# EasyEDA schematic open-ebike-latch.json
TITLE: Sheet_1; REV: 1.0; Date: 2021-06-18; Sheet: 1/1; Company: Stefano
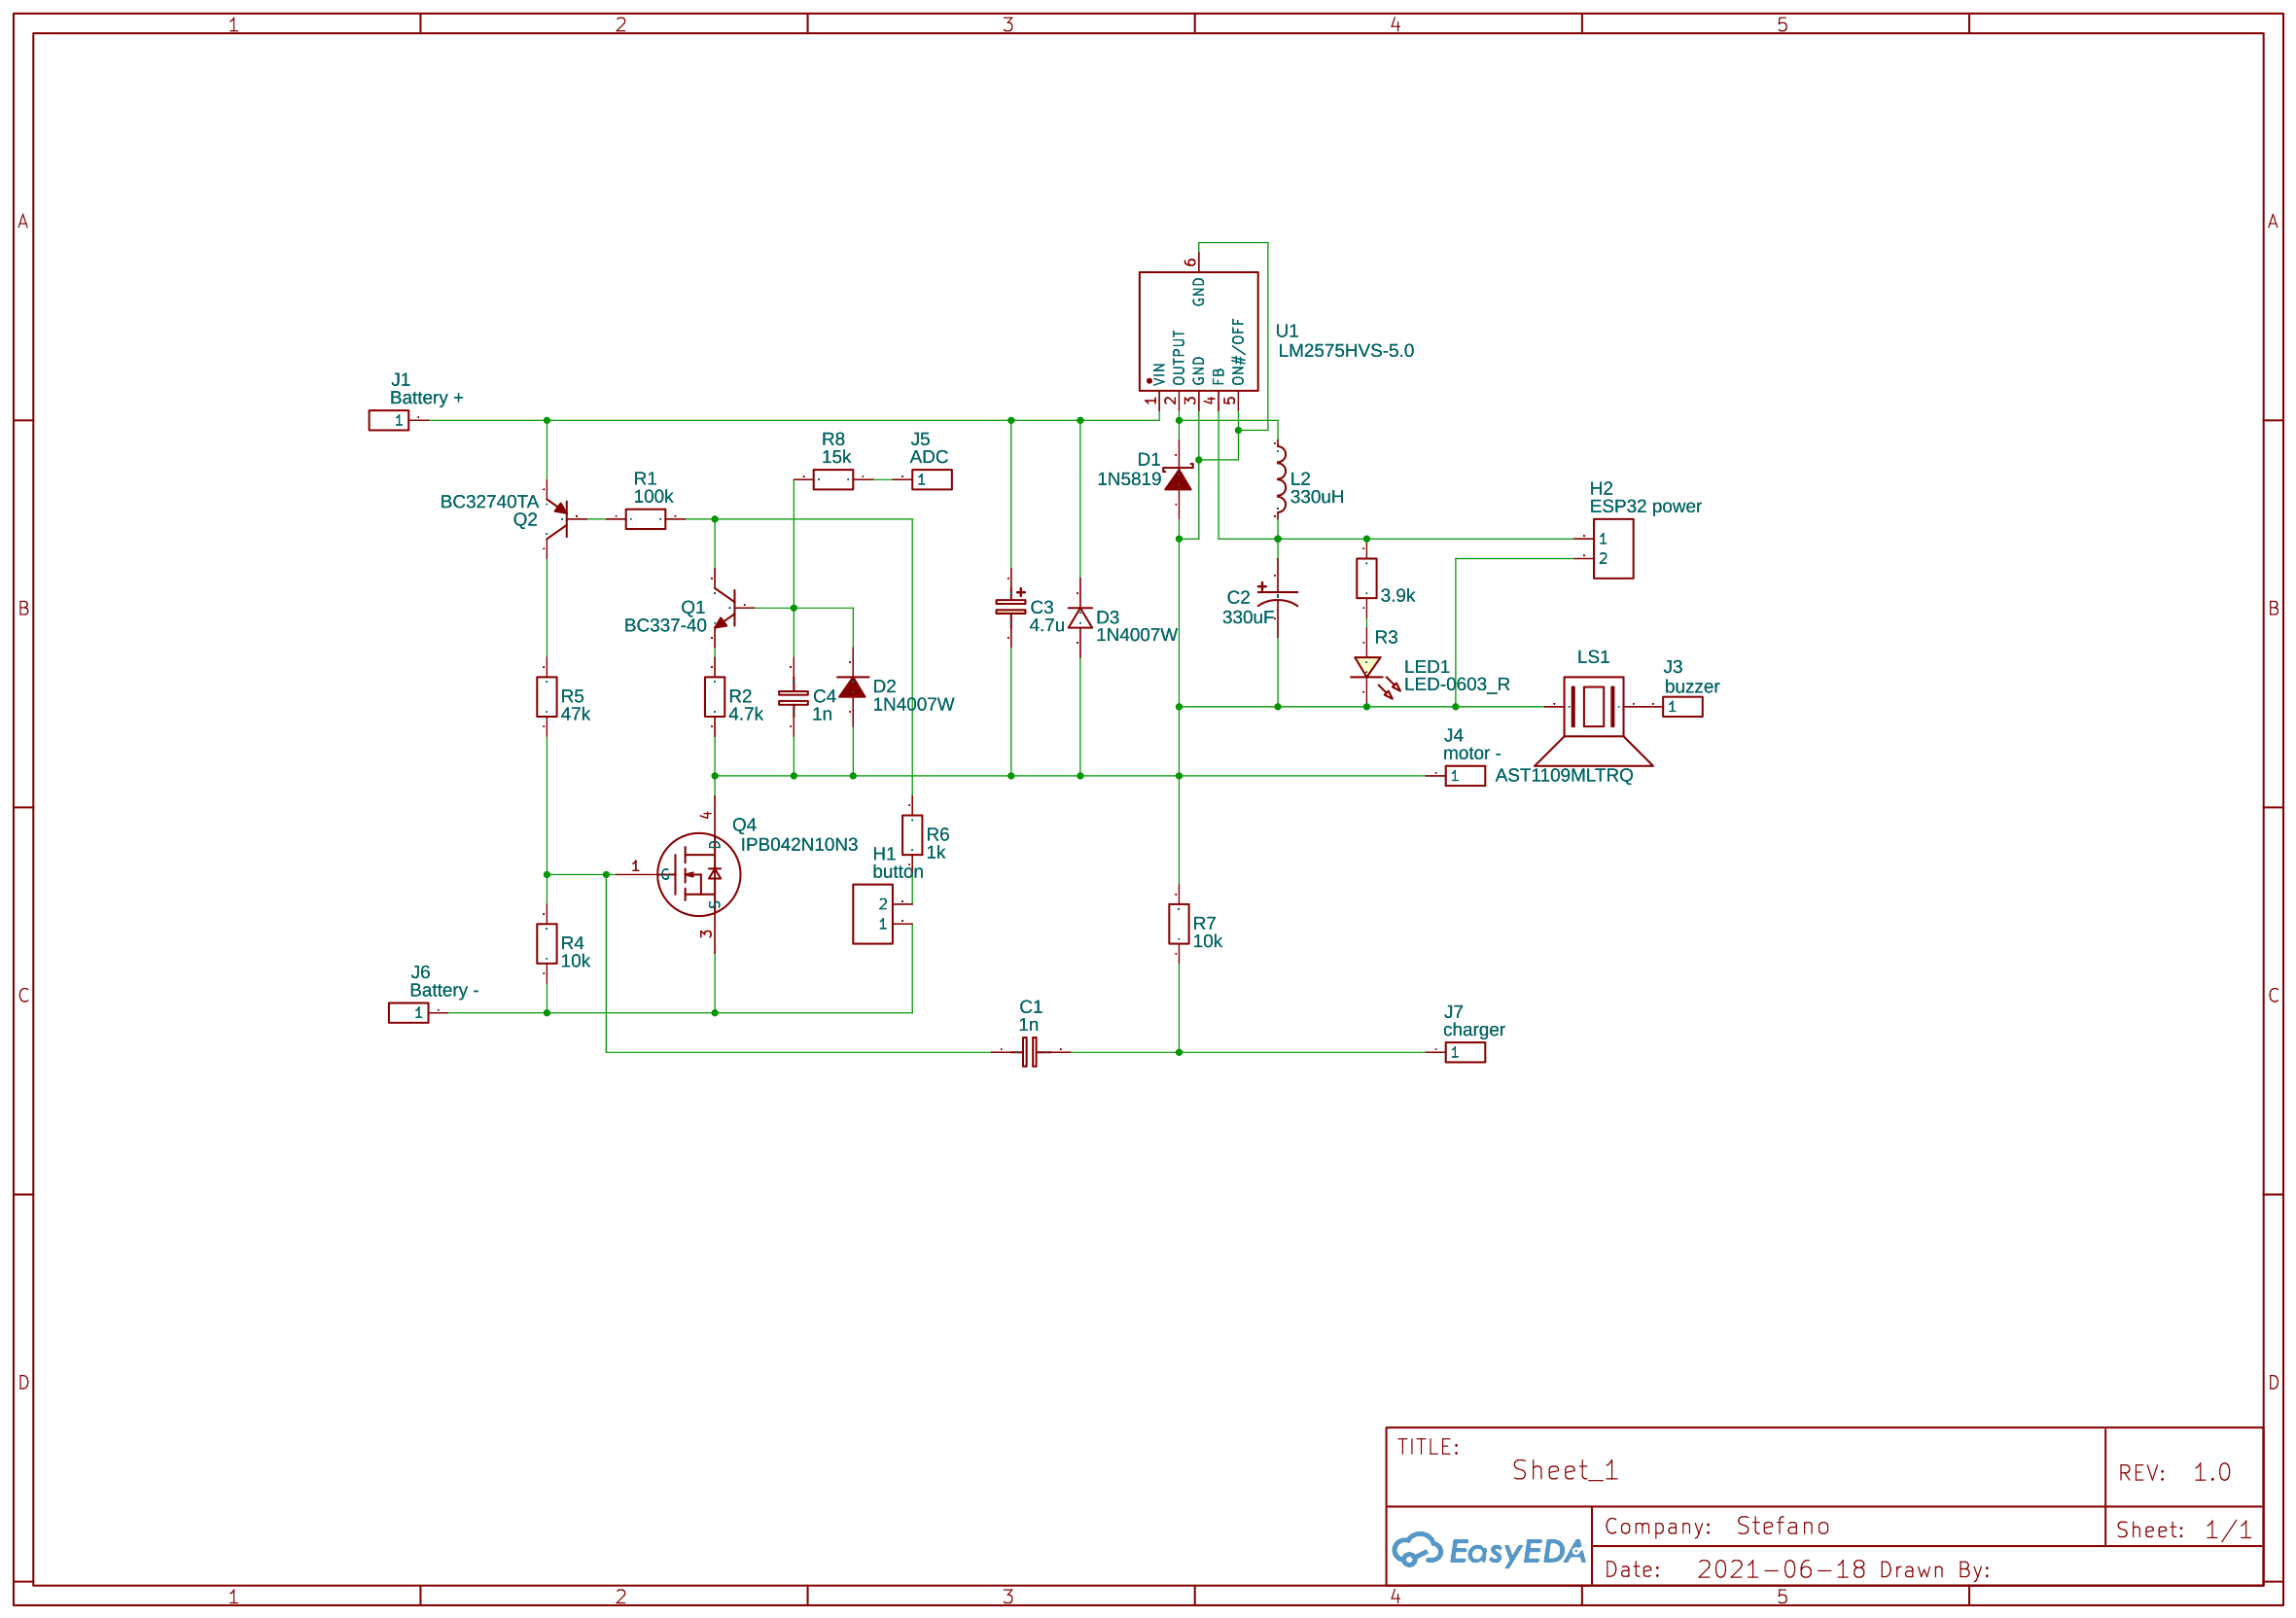
[diagram p0: schematic sheet]

## Parts
C1  1n  [RAD-0.2]
C2  330uF  [CAP-D5.0×F2.0]
C3  4.7u  [CAP-D5.0×F2.0]
C4  1n  [RAD-0.2]
D1  1N5819  [DO-41_BD2.4-L4.7-P8.70-D0.9-FD]
D2  1N4007W  [DO-35_BD2.0-L4.2-P8.20-D0.5-RD]
D3  1N4007W  [DO-35_BD2.0-L4.2-P8.20-D0.5-RD]
H1  button  [HDR-F-2.54_1X2]
H2  ESP32 power  [HDR-F-2.54_1X2]
J1  Battery +  [HDR-M-2.54_1X1]
J3  buzzer  [HDR-M-2.54_1X1]
J4  motor -  [HDR-M-2.54_1X1]
J5  ADC  [HDR-M-2.54_1X1]
J6  Battery -  [HDR-M-2.54_1X1]
J7  charger  [HDR-M-2.54_1X1]
L2  330uH  [INDUCTOR 330UH 12X12X7MM]
LED1  LED-0603_R  [LED0603_RED]
LS1  AST1109MLTRQ  [PIEZO]
Q1  BC337-40  [TO-92-3_L5.1-W4.1-P1.27-L]
Q2  BC32740TA  [TO-92-3_L5.1-W4.1-P1.27-L]
Q4  IPB042N10N3  [TO-263-2_L10.0-W9.1-P5.08-LS15.2-TL]
R1  100k  [R_AXIAL-0.4]
R2  4.7k  [R_AXIAL-0.4]
R3  3.9k  [R_AXIAL-0.4]
R4  10k  [R_AXIAL-0.4]
R5  47k  [R_AXIAL-0.4]
R6  1k  [R_AXIAL-0.4]
R7  10k  [R_AXIAL-0.4]
R8  15k  [R_AXIAL-0.4]
U1  LM2575HVS-5.0  [TO-263-5_L10.2-W8.9-P1.70-BR]

## Library data of the parts
C1 C4 = C_RAD-0.2_EU: Contributor: LCEDA_Lib; Package Display: No
C2 = UWX0J331MCL1GB: Supplier: LCSC; Supplier Part: C445051; Manufacturer: Nichicon; Contributor: LCSC
C3 = CE_TH_D5.0×F2.0_EU: Contributor: LCEDA_Lib
D1 = 1N5819: Supplier: LCSC; Manufacturer: STMicroelectronics; Supplier Part: C110032; JLCPCB Part Class: Extended Part
D2 = 1N4148: Supplier: LCSC; Manufacturer: SEMTECH; Supplier Part: C14516; JLCPCB Part Class: Extended Part
D3 = 1N4007W: Supplier: LCSC; Supplier Part: C328592; Manufacturer: BLUE ROCKET; Contributor: LCEDA_Lib
H1 H2 = HDR-F-2.54_1x2: Supplier Part: C49661; Supplier: LCSC; Contributor: LCEDA_Lib
J1 J3-J7 = HDR-M-2.54_1x1: Supplier Part: C81276; Supplier: LCSC; Contributor: LCEDA_Lib
L2 = CKL0510*330UH/K-A T: Supplier: LCSC; Supplier Part: C354671; Manufacturer: CENKER; Manufacturer Part: CKL0510*330uH/K-A T; Contributor: LCSC; JLCPCB Part Class: Extended Part
LED1 = LED-0603_R: Manufacturer: EVERLIGHT(台湾亿光); Manufacturer Part: 19-217/R6C-AL1M2VY/3T; Supplier Part: C72044; Supplier: LCSC; Contributor: LCEDA_01
LS1 = AST1109MLTRQ: Supplier Part: 458-1093-1-ND; Supplier: Digi-Key; link: http://www.digikey.com/product-detail/en/mallory-sonalert-products-inc/AST1109MLTRQ/458-1093-1-ND/1284375; Contributor: frappeyum
Q1 = BC337-40: Supplier: LCSC; Supplier Part: C713611; Manufacturer: LGE; Contributor: LCSC; JLCPCB Part Class: Extended Part
Q2 = BC32740TA: Supplier: LCSC; Supplier Part: C900785; Manufacturer: ON(安森美); Contributor: LCSC
Q4 = IRFS4310ZTRLPBF: Supplier: LCSC; Manufacturer: Infineon; Contributor: LCSC; Supplier Part: C148160; JLCPCB Part Class: Extended Part
R1-R8 = R_AXIAL-0.5_EU: Contributor: LCEDA_Lib
U1 = LM2575HVS-5.0: Supplier: LCSC; Supplier Part: C434502; Manufacturer: HGSEMI; Contributor: LCSC

## Nets
Net-(C1-1): C1.1 Q4.1(G) R4.2 R5.1
Net-(C1-2): C1.2 J7.1 R7.1
Net-(C2-1): C2.1 H2.1 L2.2 R3.2 U1.4(FB)
Net-(C2-2): C2.2 C3.2 C4.1 D1.1(A) D2.1(A) D3.2 H2.2 J4.1 LED1.2 LS1.2 Q4.4(D) R2.1 R7.2 U1.3(GND) U1.5(ON#/OFF) U1.6(GND)
Net-(C3-1): C3.1 D3.1 J1.1 Q2.3(E) U1.1(VIN)
Net-(C4-2): C4.2 D2.2(C) Q1.2(B) R8.2
Net-(D1-2): D1.2(K) L2.1 U1.2(OUTPUT)
Net-(H1-1): H1.1 J6.1 Q4.3(S) R4.1
Net-(H1-2): H1.2 R6.1
Net-(J3-1): J3.1 LS1.1
Net-(J5-1): J5.1 R8.1
Net-(LED1-1): LED1.1 R3.1
Net-(Q1-1): Q1.1(C) R1.2 R6.2
Net-(Q1-3): Q1.3(E) R2.2
Net-(Q2-1): Q2.1(C) R5.2
Net-(Q2-2): Q2.2(B) R1.1
